# EAGLE design Remote1 (EAGLE 9.6.2)
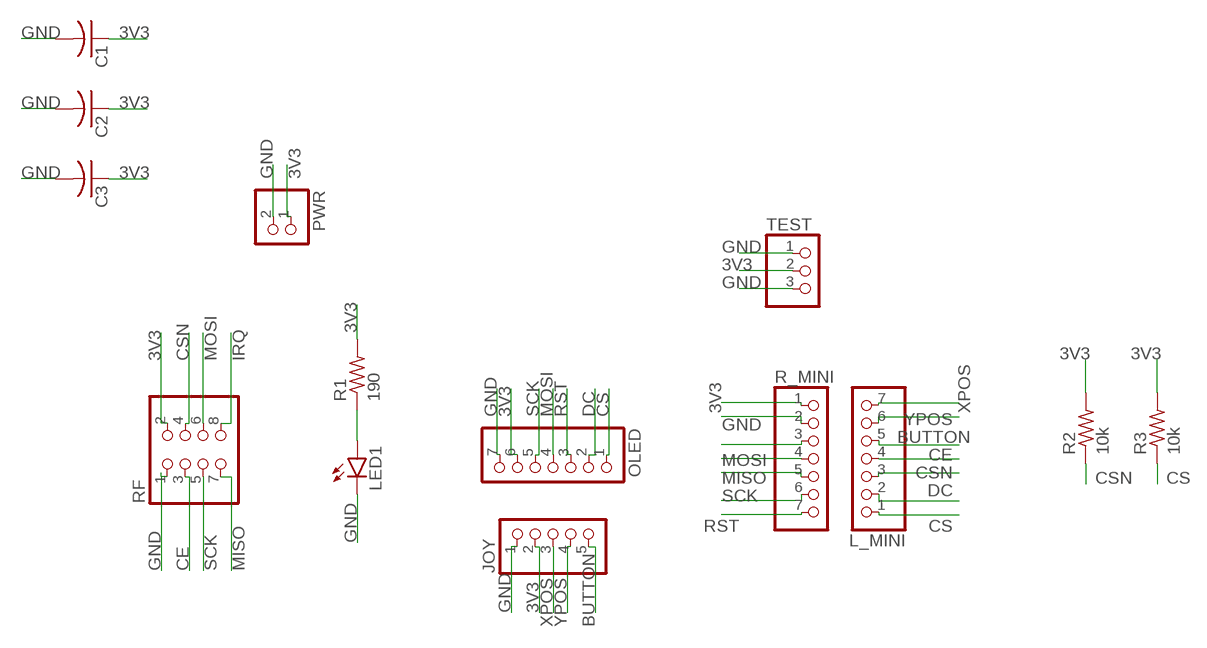
[diagram p0: schematic, sheet 1]

## Parts
C1  C-US025-024X044  [C025-024X044]
C2  C-US025-024X044  [C025-024X044]
C3  C-US025-024X044  [C025-024X044]
JOY  PINHD-1X5/90  [1X05/90]
L_MINI  PINHD-1X7  [1X07]
LED1  LED5MM  [LED5MM]
OLED  PINHD-1X7  [1X07]
PWR  PINHD-1X2  [1X02]
R1  190  R-US_0204/7  [0204/7]
R2  10k  R-US_0204/7  [0204/7]
R3  10k  R-US_0204/7  [0204/7]
R_MINI  PINHD-1X7  [1X07]
RF  PINHD-2X4  [2X04]
TEST  PINHD-1X3  [1X03]

## Nets
3V3: C1.1 C2.1 C3.1 JOY.2 OLED.6 PWR.1 R1.2 R2.2 R3.2 R_MINI.1 RF.2 TEST.2
BUTTON: JOY.5 L_MINI.5
CE: L_MINI.4 RF.3
CS: L_MINI.1 OLED.1 R3.1
CSN: L_MINI.3 R2.1 RF.4
DC: L_MINI.2 OLED.2
GND: C1.2 C2.2 C3.2 JOY.1 LED1.K(C) OLED.7 PWR.2 R_MINI.2 RF.1 TEST.1 TEST.3
IRQ: RF.8
MISO: R_MINI.5 RF.7
MOSI: OLED.4 R_MINI.4 RF.6
N$3: LED1.A R1.1
N$4: R_MINI.3
RST: OLED.3 R_MINI.7
SCK: OLED.5 R_MINI.6 RF.5
XPOS: JOY.3 L_MINI.7
YPOS: JOY.4 L_MINI.6

## Library data of the parts
C1-C3 = rcl:C-US: CAPACITOR, American symbol; SPICEPREFIX: C
JOY = pinhead:PINHD-1X5: PIN HEADER
L_MINI OLED R_MINI = pinhead:PINHD-1X7: PIN HEADER
LED1 = led:LED: LED OSRAM: - CHIPLED LG R971, LG N971, LY N971, LG Q971, LY Q971, LO R971, LY R971 LH N974, LH R974 LS Q976, LO Q976, LY Q976 LO Q996 - Hyper CHIPLED LW Q18S LB Q993, LB Q99A, LB R99A - SideLED LS A670, LO A670, LY A670, LG A670, LP A670 LB A673, LV A673, LT A673, LW A673 LH A674 LY A675 LS A676, LA A676, LO A676, LY A676, LW A676 LS A679, LY A679, LG A679 - Hyper Micro SIDELED® LS Y876, LA Y876, LO Y876, LY Y876 LT Y87S - SmartLED LW L88C, LW L88S LB L89C, LB L89S, LG L890 LS L89K, LO L89K, LY L89K LS L896, LA L896, LO L896, LY L896 - TOPLED LS T670, LO T670, LY T670, LG T670, LP T670 LSG T670, LSP T670, LSY T670, LOP T670, LYG T670 LG T671, LOG T671, LSG T671 LB T673, LV T673, LT T673, LW T673 LH T674 LS T676, LA T676, LO T676, LY T676, LB T676, LH T676, LSB T676, LW T676 LB T67C, LV T67C, LT T67C, LS T67K, LO T67K, LY T67K, LW E67C LS E67B, LA E67B, LO E67B, LY E67B, LB E67C, LV E67C, LT E67C LW T67C LS T679, LY T679, LG T679 LS T770, LO T770, LY T770, LG T770, LP T770 LB T773, LV T773, LT T773, LW T773 LH T774 LS E675, LA E675, LY E675, LS T675 LS T776, LA T776, LO T776, LY T776, LB T776 LHGB T686 LT T68C, LB T68C - Hyper Mini TOPLED® LB M676 - Mini TOPLED Santana® LG M470 LS M47K, LO M47K, LY M47K Source: http://www.osram.convergy.de LUXEON: - LUMILED® LXK2-PW12-R00, LXK2-PW12-S00, LXK2-PW14-U00, LXK2-PW14-V00 LXK2-PM12-R00, LXK2-PM12-S00, LXK2-PM14-U00 LXK2-PE12-Q00, LXK2-PE12-R00, LXK2-PE12-S00, LXK2-PE14-T00, LXK2-PE14-U00 LXK2-PB12-K00, LXK2-PB12-L00, LXK2-PB12-M00, LXK2-PB14-N00, LXK2-PB14-P00, LXK2-PB14-Q00 LXK2-PR12-L00, LXK2-PR12-M00, LXK2-PR14-Q00, LXK2-PR14-R00 LXK2-PD12-Q00, LXK2-PD12-R00, LXK2-PD12-S00 LXK2-PH12-R00, LXK2-PH12-S00 LXK2-PL12-P00, LXK2-PL12-Q00, LXK2-PL12-R00 Source: www.luxeon.com KINGBRIGHT: KA-3528ASYC Source: www.kingbright.com
PWR = pinhead:PINHD-1X2: PIN HEADER
R1-R3 = rcl:R-US_: RESISTOR, American symbol; SPICEPREFIX: R
RF = pinhead:PINHD-2X4: PIN HEADER
TEST = pinhead:PINHD-1X3: PIN HEADER

## Board
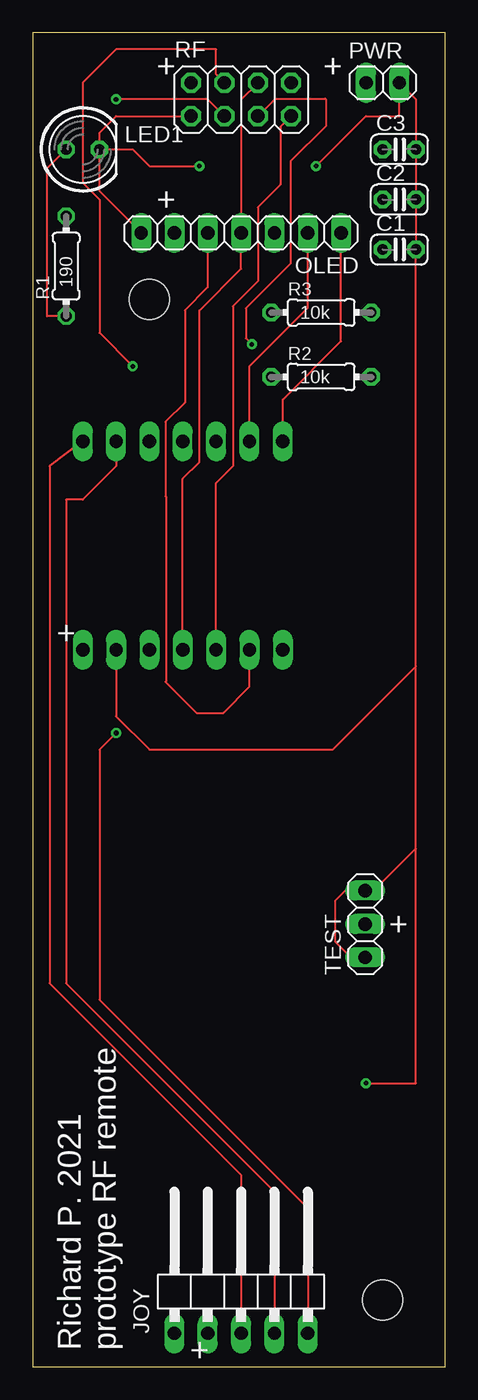
[diagram p1: board, top side]
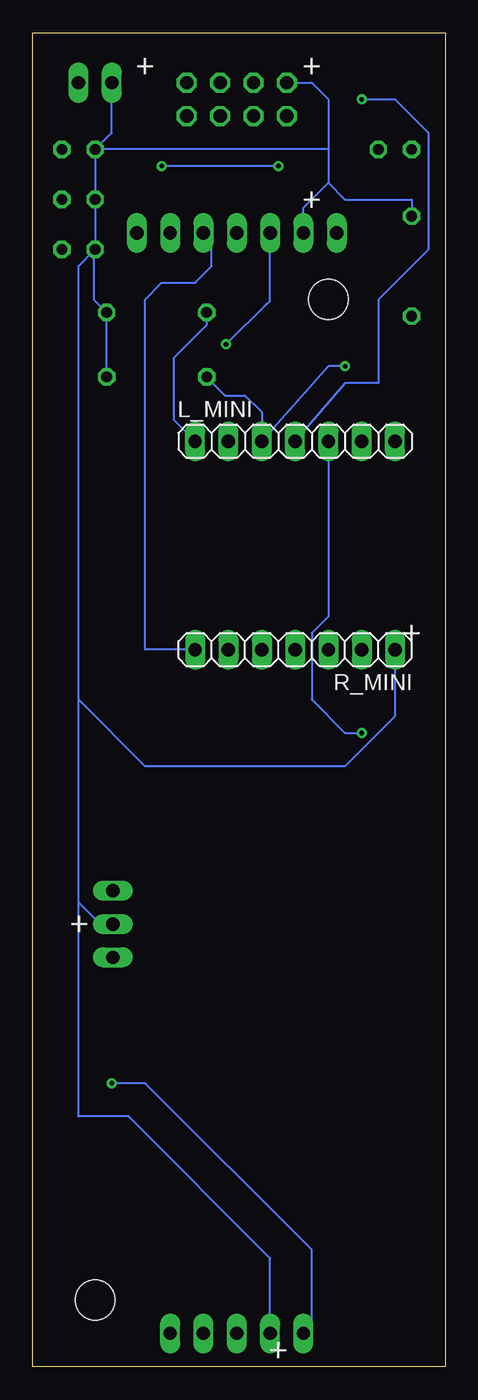
[diagram p2: board, bottom side, seen from below]

Size 31.42 x 101.59 mm. Coordinates in mm from the lower left corner, seen from the top.
Outline: 0,0 31.42,0 31.42,101.59 0,101.59 0,0
Copper layers (1*16): Top 0.035mm / dielectric 1.5mm / Bottom 0.035mm
Design rules "default": minimum track width 6mil, minimum drill 0.35mm, track to track 6mil, track to pad 6mil, pad to pad 6mil, via to via 6mil, smd to smd 6mil, copper to edge 40mil, drill to drill 6mil, minimum pad ring 10mil, minimum via ring 8mil, stop-mask expansion 4mil, vias tented up to drill 0mil, thermal gap 10mil
Holes 3.05 mm at 8.89,81.28 26.67,5.08

### Footprints (pad centres in the part's own frame; a part is rotated, then mirrored left to right if it is on the bottom)
C025-024X044 = drill 0.813 octagon: 1 -1.27,0; 2 1.27,0
1X05/90 = drill 1.016 long: 1 -5.08,-3.81; 2 -2.54,-3.81; 3 0,-3.81; 4 2.54,-3.81; 5 5.08,-3.81
1X07 = drill 1.016 long: 1 -7.62,0; 2 -5.08,0; 3 -2.54,0; 4 0,0; 5 2.54,0; 6 5.08,0; 7 7.62,0
LED5MM = drill 0.813 octagon: A -1.27,0; K 1.27,0
1X02 = drill 1.016 long: 1 -1.27,0; 2 1.27,0
0204/7 = drill 0.813 octagon: 1 -3.81,0; 2 3.81,0
2X04 = drill 1.016 octagon: 1 -3.81,-1.27; 2 -3.81,1.27; 3 -1.27,-1.27; 4 -1.27,1.27; 5 1.27,-1.27; 6 1.27,1.27; 7 3.81,-1.27; 8 3.81,1.27
1X03 = drill 1.016 long: 1 -2.54,0; 2 0,0; 3 2.54,0

### Placement (x,y rotation side)
C1  27.94,85.09 0 top
C2  27.94,88.9 0 top
C3  27.94,92.71 0 top
JOY  15.88,6.35 0 top
L_MINI  11.43,70.48 0 bottom
LED1  3.81,92.71 0 top
OLED  15.88,86.36 180 top
PWR  26.67,97.79 0 top
R1  2.54,83.82 90 top
R2  21.98,75.38 0 top
R3  21.98,80.29 0 top
R_MINI  11.43,54.61 180 bottom
RF  15.88,96.52 0 top
TEST  25.32,33.71 90 top

### Tracks (layer width: path | path; a pad name or v marks a point on that pad's centre or on a via)
3V3
  Bottom 0.152: RF.2 10.16,97.79 8.89,96.52 8.89,92.71 | 8.89,92.71 8.89,90.17 | 8.89,90.17 7.62,88.9 2.54,88.9 R1.2 | 8.89,92.71 C3.1 | C3.1 25.4,93.98 PWR.1 | C3.1 C2.1 C1.1 26.73,85.03 | OLED.6 10.79,88.27 8.89,90.17 | JOY.2 13.34,8.26 24.13,19.05 27.94,19.05 27.94,35.35 | 26.73,85.03 27.94,83.82 27.94,50.8 | 27.94,35.35 27.94,50.8 | R_MINI.1 3.81,49.53 7.62,45.72 22.86,45.72 27.94,50.8 | 27.94,35.35 26.26,33.68 25.36,33.68 TEST.2 | 26.73,85.03 26.73,81.22 R3.2 R2.2
BUTTON  (via drill 0.35)
  Top 0.152: v6.35,48.26 5.08,46.99 5.08,27.94 20.95,12.06 JOY.5
  Bottom 0.152: L_MINI.5 8.89,57.15 10.16,55.88 10.16,50.8 7.62,48.26 v6.35,48.26
CE  (via drill 0.35)
  Top 0.152: RF.3 13.34,96.52 v6.35,96.52
  Bottom 0.152: L_MINI.4 7.62,74.93 5.08,74.93 5.08,81.28 1.27,85.09 1.27,93.98 3.81,96.52 v6.35,96.52
CS
  Top 0.152: L_MINI.1 19.05,73.66 23.5,78.11 OLED.1
  Bottom 0.152: R3.1 18.17,79.33 20.68,76.82 20.68,72.12 L_MINI.1
CSN  (via drill 0.35)
  Top 0.152: RF.4 13.97,98.42 13.97,100.33 6.35,100.33 3.81,97.79 3.81,90.17 5.08,88.9 5.08,78.74 v7.62,76.2
  Bottom 0.152: v7.62,76.2 8.89,76.2 L_MINI.3 13.97,72.69 15.25,73.97 16.76,73.97 R2.1
DC
  Top 0.152: L_MINI.2 16.51,76.2 20.95,80.64 OLED.2
GND  (via drill 0.35)
  Top 0.152: LED1.K 5.08,93.98 6.35,95.25 RF.1 | OLED.7 5.08,89.53 LED1.K | 29.21,39.47 29.21,21.59 v25.4,21.59 | 29.21,39.47 29.21,53.34 | 29.21,53.34 C1.2 C2.2 C3.2 29.21,96.52 PWR.2 27.94,95.25 25.4,95.25 v21.59,91.44 | LED1.K 7.62,92.71 8.89,91.44 v12.7,91.44 | 29.21,53.34 22.86,46.99 8.89,46.99 6.35,49.53 R_MINI.2 | 29.21,39.47 26,36.25 TEST.3 | TEST.3 | TEST.3 23.82,36.25 23.03,35.46 23.03,32.38 24.27,31.14 25.29,31.14 TEST.1
  Bottom 0.152: v12.7,91.44 v21.59,91.44 | JOY.1 10.16,3.17 10.16,8.89 22.86,21.59 v25.4,21.59
MISO
  Top 0.152: R_MINI.5 13.97,67.31 15.24,68.58 15.24,80.76 17.15,82.67 17.15,88.31 18.87,90.03 18.87,94.44 RF.7
MOSI
  Top 0.152: R_MINI.4 11.43,67.64 12.7,68.9 12.7,80.44 15.88,83.62 OLED.4 15.89,96.51 17.14,97.77 RF.6
N$3
  Top 0.152: R1.1 1.09,80.01 1.09,91.26 LED1.A
RST
  Bottom 0.152: R_MINI.7 22.86,54.61 22.86,81.28 21.59,82.55 19.05,82.55 17.78,83.82 17.78,85.72 OLED.3
SCK  (via drill 0.35)
  Top 0.152: OLED.5 13.34,82.21 11.59,80.47 11.59,73.44 10.12,71.96 10.12,66.3 10.14,66.28 10.14,52.19 10.11,52.15 12.46,49.8 14.52,49.8 16.51,51.79 R_MINI.6 | RF.5 18.48,96.59 22.27,96.59 22.32,96.53 22.32,94.47 19.65,91.8 19.65,84.01 16.25,80.6 16.25,78.32 v16.69,77.87
  Bottom 0.152: v16.69,77.87 13.63,80.94 13.57,80.94 13.34,81.17 OLED.5
XPOS
  Top 0.152: L_MINI.7 1.27,68.58 1.27,29.21 15.88,14.61 JOY.3
YPOS
  Top 0.152: L_MINI.6 6.35,68.58 3.81,66.04 2.54,66.04 2.54,29.21 18.41,13.34 JOY.4

### Text on the board
tPlace: + | + | + | + | + | Richard P. 2021 / prototype RF remote | +
bPlace: + | + | + | + | + | +